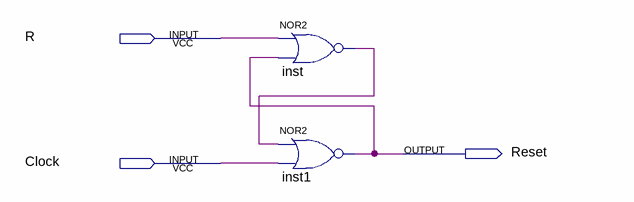
[diagram p0: schematic sheet]
// Quartus schematic RS_Latch.bdf as structural Verilog: 2 symbols, 3 pins
module RS_Latch (
  input  R,
  input  Clock,
  output Reset
);

  wire inst_out;

  nor inst (inst_out, R, Reset);
  nor inst1 (Reset, inst_out, Clock);
endmodule
